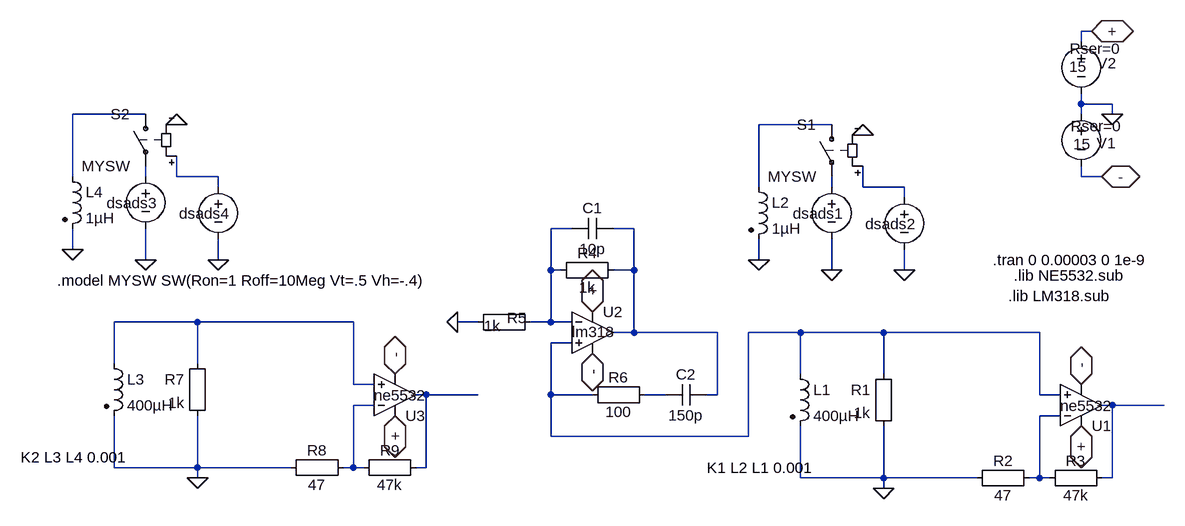
[diagram p0: schematic nehative_capcaitance_does_something_6.asc]
nehative_capcaitance_does_something_6.asc, the LTspice schematic file:
Version 4
SHEET 1 880 680
WIRE -1088 -256 -1104 -256
WIRE -1104 -240 -1104 -256
WIRE -1104 -144 -1104 -160
WIRE -1056 -144 -1104 -144
WIRE -2544 -128 -2656 -128
WIRE -1104 -128 -1104 -144
WIRE -1056 -128 -1056 -144
WIRE -1488 -112 -1600 -112
WIRE -2656 -32 -2656 -128
WIRE -2544 -32 -2544 -48
WIRE -2496 -32 -2496 -64
WIRE -2432 -32 -2496 -32
WIRE -1104 -32 -1104 -48
WIRE -1072 -32 -1104 -32
WIRE -2432 -16 -2432 -32
WIRE -1600 -16 -1600 -112
WIRE -1488 -16 -1488 -32
WIRE -1440 -16 -1440 -48
WIRE -1376 -16 -1440 -16
WIRE -1376 0 -1376 -16
WIRE -1888 48 -1920 48
WIRE -1792 48 -1824 48
WIRE -2656 80 -2656 48
WIRE -2544 96 -2544 48
WIRE -2432 96 -2432 64
WIRE -1600 96 -1600 64
WIRE -1920 112 -1920 48
WIRE -1904 112 -1920 112
WIRE -1792 112 -1792 48
WIRE -1792 112 -1824 112
WIRE -1488 112 -1488 64
WIRE -1376 112 -1376 80
WIRE -2464 192 -2592 192
WIRE -2224 192 -2464 192
WIRE -2032 192 -2064 192
WIRE -1920 192 -1920 112
WIRE -1920 192 -1952 192
WIRE -1888 192 -1920 192
WIRE -1792 208 -1792 112
WIRE -1792 208 -1824 208
WIRE -1664 208 -1792 208
WIRE -1536 208 -1616 208
WIRE -1408 208 -1536 208
WIRE -1168 208 -1408 208
WIRE -1888 224 -1920 224
WIRE -2592 256 -2592 192
WIRE -2464 256 -2464 192
WIRE -1536 272 -1536 208
WIRE -1408 272 -1408 208
WIRE -2224 288 -2224 192
WIRE -2192 288 -2224 288
WIRE -2112 304 -2128 304
WIRE -2032 304 -2112 304
WIRE -1920 304 -1920 224
WIRE -1856 304 -1920 304
WIRE -1744 304 -1776 304
WIRE -1664 304 -1664 208
WIRE -1664 304 -1680 304
WIRE -1168 304 -1168 208
WIRE -1136 304 -1168 304
WIRE -2192 320 -2224 320
WIRE -1056 320 -1072 320
WIRE -976 320 -1056 320
WIRE -1136 336 -1168 336
WIRE -1920 368 -1920 304
WIRE -1616 368 -1616 208
WIRE -1616 368 -1920 368
WIRE -2592 416 -2592 336
WIRE -2464 416 -2464 336
WIRE -2464 416 -2592 416
WIRE -2320 416 -2464 416
WIRE -2224 416 -2224 320
WIRE -2224 416 -2240 416
WIRE -2208 416 -2224 416
WIRE -2112 416 -2112 304
WIRE -2112 416 -2128 416
WIRE -2464 432 -2464 416
WIRE -1536 432 -1536 352
WIRE -1408 432 -1408 352
WIRE -1408 432 -1536 432
WIRE -1264 432 -1408 432
WIRE -1168 432 -1168 336
WIRE -1168 432 -1184 432
WIRE -1152 432 -1168 432
WIRE -1056 432 -1056 320
WIRE -1056 432 -1072 432
WIRE -1408 448 -1408 432
FLAG -1072 -32 -
IOPIN -1072 -32 BiDir
FLAG -1088 -256 +
IOPIN -1088 -256 BiDir
FLAG -1056 -128 0
FLAG -1104 352 +
IOPIN -1104 352 BiDir
FLAG -1104 288 -
IOPIN -1104 288 BiDir
FLAG -1856 176 +
IOPIN -1856 176 BiDir
FLAG -1856 240 -
IOPIN -1856 240 BiDir
FLAG -2064 192 0
FLAG -1408 448 0
FLAG -1488 112 0
FLAG -1376 112 0
FLAG -1600 96 0
FLAG -1440 -96 0
FLAG -2160 336 +
IOPIN -2160 336 BiDir
FLAG -2160 272 -
IOPIN -2160 272 BiDir
FLAG -2464 432 0
FLAG -2544 96 0
FLAG -2432 96 0
FLAG -2656 80 0
FLAG -2496 -112 0
SYMBOL voltage -1104 -144 M0
WINDOW 123 0 0 Left 2
WINDOW 39 -63 34 Left 2
WINDOW 0 -53 60 Left 2
WINDOW 3 -15 62 Left 2
SYMATTR SpiceLine Rser=0
SYMATTR InstName V1
SYMATTR Value 15
SYMBOL voltage -1104 -256 M0
WINDOW 123 0 0 Left 2
WINDOW 39 -61 27 Left 2
WINDOW 0 -54 49 Left 2
WINDOW 3 -9 55 Left 2
SYMATTR SpiceLine Rser=0
SYMATTR InstName V2
SYMATTR Value 15
SYMBOL Misc\\EuropeanResistor -1392 256 M0
SYMATTR InstName R1
SYMATTR Value 1k
SYMBOL Opamps\\opamp2 -1104 384 M180
WINDOW 3 -32 63 Left 2
SYMATTR Value ne5532
SYMATTR InstName U1
SYMBOL Misc\\EuropeanResistor -1280 448 R270
WINDOW 0 27 56 VTop 2
WINDOW 3 5 56 VBottom 2
SYMATTR InstName R2
SYMATTR Value 47
SYMBOL Misc\\EuropeanResistor -1168 448 R270
WINDOW 0 27 56 VTop 2
WINDOW 3 5 56 VBottom 2
SYMATTR InstName R3
SYMATTR Value 47k
SYMBOL ind2 -1552 256 R0
SYMATTR InstName L1
SYMATTR Value 400µH
SYMATTR SpiceLine Rser=.4 Cpar=220p
SYMATTR Type ind
SYMBOL Opamps\\opamp2 -1856 144 R0
WINDOW 3 -32 63 Left 2
SYMATTR Value lm318
SYMATTR InstName U2
SYMBOL Misc\\EuropeanResistor -1920 96 M90
WINDOW 0 5 56 VBottom 2
WINDOW 3 27 56 VTop 2
SYMATTR InstName R4
SYMATTR Value 1k
SYMBOL Misc\\EuropeanCap -1824 64 M270
WINDOW 0 32 32 VTop 2
WINDOW 3 0 32 VBottom 2
SYMATTR InstName C1
SYMATTR Value 10p
SYMATTR SpiceLine V=400 Irms=1 Rser=.32 Lser=0
SYMBOL Misc\\EuropeanResistor -2048 176 M90
WINDOW 0 25 76 VBottom 2
WINDOW 3 6 38 VTop 2
SYMATTR InstName R5
SYMATTR Value 1k
SYMBOL Misc\\EuropeanCap -1680 320 M270
WINDOW 0 32 32 VTop 2
WINDOW 3 0 32 VBottom 2
SYMATTR InstName C2
SYMATTR Value 150p
SYMATTR SpiceLine V=400 Irms=1 Rser=.32 Lser=0
SYMBOL Misc\\EuropeanResistor -1872 288 M90
WINDOW 0 5 56 VBottom 2
WINDOW 3 27 56 VTop 2
SYMATTR InstName R6
SYMATTR Value 100
SYMBOL ind2 -1616 -32 R0
SYMATTR InstName L2
SYMATTR Value 1µH
SYMATTR SpiceLine Rser=.1 Rpar=1 Cpar=1p
SYMATTR Type ind
SYMBOL voltage -1488 -32 M0
WINDOW 0 -18 57 Left 2
WINDOW 3 -134 119 Invisible 2
WINDOW 123 0 0 Left 2
SYMATTR InstName dsads1
SYMATTR Value .01
SYMATTR SpiceLine Rser=0
SYMBOL sw -1488 -128 M0
SYMATTR InstName S1
SYMATTR Value MYSW
SYMBOL voltage -1376 -16 M0
WINDOW 0 -18 57 Left 2
WINDOW 3 -134 119 Invisible 2
WINDOW 123 0 0 Left 2
WINDOW 39 0 0 Left 2
SYMATTR InstName dsads2
SYMATTR Value PULSE(0 10 0.000001 1e-10 1e-10 .000001 .0001 1)
SYMBOL Misc\\EuropeanResistor -2448 240 M0
SYMATTR InstName R7
SYMATTR Value 1k
SYMBOL Opamps\\opamp2 -2160 368 M180
WINDOW 3 -32 63 Left 2
SYMATTR Value ne5532
SYMATTR InstName U3
SYMBOL Misc\\EuropeanResistor -2336 432 R270
WINDOW 0 27 56 VTop 2
WINDOW 3 5 56 VBottom 2
SYMATTR InstName R8
SYMATTR Value 47
SYMBOL Misc\\EuropeanResistor -2224 432 R270
WINDOW 0 27 56 VTop 2
WINDOW 3 5 56 VBottom 2
SYMATTR InstName R9
SYMATTR Value 47k
SYMBOL ind2 -2608 240 R0
SYMATTR InstName L3
SYMATTR Value 400µH
SYMATTR SpiceLine Rser=.4 Cpar=220p
SYMATTR Type ind
SYMBOL ind2 -2672 -48 R0
SYMATTR InstName L4
SYMATTR Value 1µH
SYMATTR SpiceLine Rser=.1 Rpar=1 Cpar=1p
SYMATTR Type ind
SYMBOL voltage -2544 -48 M0
WINDOW 0 -18 57 Left 2
WINDOW 3 -134 119 Invisible 2
WINDOW 123 0 0 Left 2
SYMATTR InstName dsads3
SYMATTR Value .01
SYMATTR SpiceLine Rser=0
SYMBOL sw -2544 -144 M0
SYMATTR InstName S2
SYMATTR Value MYSW
SYMBOL voltage -2432 -32 M0
WINDOW 0 -18 57 Left 2
WINDOW 3 -134 119 Invisible 2
WINDOW 123 0 0 Left 2
WINDOW 39 0 0 Left 2
SYMATTR InstName dsads4
SYMATTR Value PULSE(0 10 0.000001 1e-10 1e-10 .000001 .0001 1)
TEXT -1240 96 Left 2 !.tran 0 0.00003 0 1e-9
TEXT -1208 120 Left 2 !.lib NE5532.sub
TEXT -1216 152 Left 2 !.lib LM318.sub
TEXT -1680 416 Left 2 !K1 L2 L1 0.001
TEXT -2680 128 Left 2 !.model MYSW SW(Ron=1 Roff=10Meg Vt=.5 Vh=-.4)
TEXT -2736 400 Left 2 !K2 L3 L4 0.001

The netlist it stands for:
* nehative_capcaitance_does_something_6.asc
V1 0 - 15 Rser=0
V2 + 0 15 Rser=0
R1 N010 0 1k
XU1 N010 N015 + - N014 ne5532  ; pins In+ In- V+ V- OUT
R2 0 N015 47
R3 N015 N014 47k
L1 N010 0 400µH Rser=.4 Cpar=220p
XU2 N010 N007 + - N008 lm318  ; pins In+ In- V+ V- OUT
R4 N007 N008 1k
C1 N008 N007 10p V=400 Irms=1 Rser=.32 Lser=0
R5 0 N007 1k
C2 N008 N012 150p V=400 Irms=1 Rser=.32 Lser=0
R6 N010 N012 100
L2 N002 0 1µH Rser=.1 Rpar=1 Cpar=1p
V§dsads1 N005 0 .01 Rser=0
S1 N002 N005 N006 0 MYSW
V§dsads2 N006 0 PULSE(0 10 0.000001 1e-10 1e-10 .000001 .0001 1)
R7 N009 0 1k
XU3 N009 N013 + - N011 ne5532  ; pins In+ In- V+ V- OUT
R8 0 N013 47
R9 N013 N011 47k
L3 N009 0 400µH Rser=.4 Cpar=220p
L4 N001 0 1µH Rser=.1 Rpar=1 Cpar=1p
V§dsads3 N003 0 .01 Rser=0
S2 N001 N003 N004 0 MYSW
V§dsads4 N004 0 PULSE(0 10 0.000001 1e-10 1e-10 .000001 .0001 1)
.tran 0 0.00003 0 1e-9
.lib NE5532.sub
.lib LM318.sub
K1 L2 L1 0.001
.model MYSW SW(Ron=1 Roff=10Meg Vt=.5 Vh=-.4)
K2 L3 L4 0.001
.backanno
.end